# EAGLE design cfs_5 (EAGLE 8.2.2)
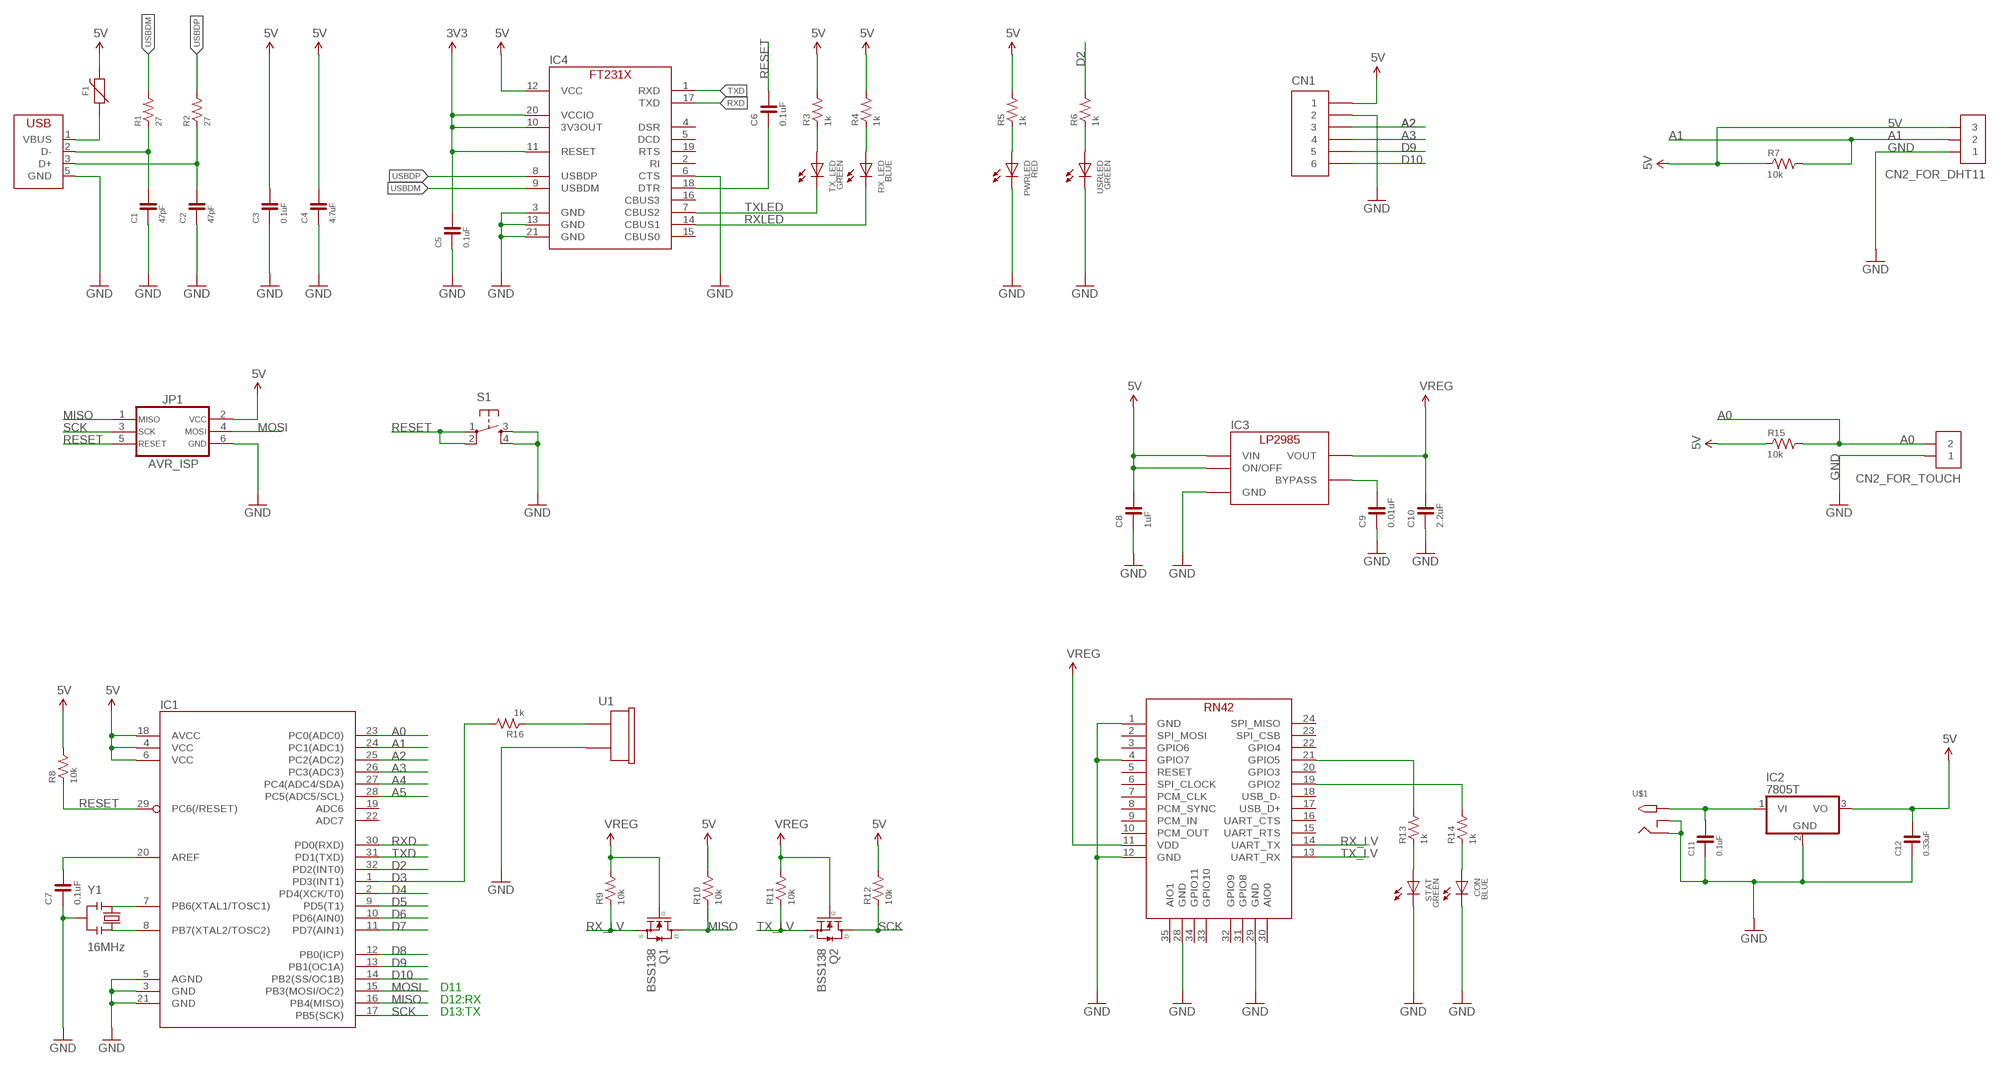
[diagram p0: schematic, sheet 1]

## Parts
C1  47pF  CAPACITOR-0603  [EIA0603]
C2  47pF  CAPACITOR-0603  [EIA0603]
C3  0.1uF  CAPACITOR-0603  [EIA0603]
C4  4.7uF  CAPACITOR-0603  [EIA0603]
C5  0.1uF  CAPACITOR-0603  [EIA0603]
C6  0.1uF  CAPACITOR-0603  [0603]
C7  0.1uF  CAPACITOR-0603  [0603]
C8  1uF  CAPACITOR-0603  [0603]
C9  0.01uF  CAPACITOR-0603  [0603]
C10  2.2uF  CAPACITOR-0603  [0603]
C11  0.1uF  CAPACITOR-0603  [EIA0603]
C12  0.33uF  CAPACITOR-0603  [EIA0603]
CN1  PIN_HEADER_1X6  [PIN_1X6]
CN2_FOR_DHT11  PIN_HEADER_1X3  [PIN_1X3]
CN2_FOR_TOUCH  PIN_HEADER_1X2  [PIN_1X2]
CON  BLUE  LED-0603  [0603]
F1  FUSE-NANO  [NANOSMDC035F]
IC1  ATMEGA328P-AU  [TQFP-32]
IC2  7805T  [TO220H]
IC3  LP2985-33DBV  [SOT-23-5]
IC4  FT231XQ  [QFN-20_FT231X]
JP1  AVR_ISP  AVR_ISP-TC2030_NOHOLE  [TC2030]
PWRLED  RED  LED-0603  [0603]
Q1  BSS138  MOSFET-N  [SOT23-3]
Q2  BSS138  MOSFET-N  [SOT23-3]
R1  27  RESISTOR-0603  [EIA0603]
R2  27  RESISTOR-0603  [EIA0603]
R3  1k  RESISTOR-0603  [0603]
R4  1k  RESISTOR-0603  [0603]
R5  1k  RESISTOR-0603  [0603]
R6  1k  RESISTOR-0603  [0603]
R7  10k  RESISTOR-0603  [0603]
R8  10k  RESISTOR-0603  [0603]
R9  10k  RESISTOR-0603  [0603]
R10  10k  RESISTOR-0603  [0603]
R11  10k  RESISTOR-0603  [0603]
R12  10k  RESISTOR-0603  [0603]
R13  1k  RESISTOR-0603  [0603]
R14  1k  RESISTOR-0603  [0603]
R15  10k  RESISTOR-0603  [0603]
R16  1k  RESISTOR-0603  [0603]
RX_LED  BLUE  LED-0603  [0603]
S1  TACT-SWITCH-SMD_KMR2  [KMR2]
STAT  GREEN  LED-0603  [0603]
TX_LED  GREEN  LED-0603  [0603]
U1  BUZZER  [PKM13EPYH4000-A0]
U$1  2.1MMJACKTHM  [PJ-102A]
U$4  MICROCHIP-RN42  [MICROCHIP-RN42]
USB1  USB-MICRO_B_SMT_HIROSE  [ZX62R-B-5P]
USRLED  GREEN  LED-0603  [0603]
Y1  16MHz  RESONATOR-CSTCE_V  [CSTCE_V]

## Nets
3V3: C5.2 IC4.10(3V3OUT) IC4.11(RESET) IC4.20(VCCIO)
5V: C3.2 C4.2 C8.2 C12.2 CN1.1 CN2_FOR_DHT11.3 F1.2 IC1.4(VCC) IC1.6(VCC) IC1.18(AVCC) IC2.3(VO) IC3.1(VIN) IC3.3(ON/OFF) IC4.12(VCC) JP1.2 R3.2 R4.2 R5.2 R7.1 R8.2 R10.2 R12.2 R15.1
A0: CN2_FOR_TOUCH.2 IC1.23(PC0(ADC0)) R15.2
A1: CN2_FOR_DHT11.2 IC1.24(PC1(ADC1)) R7.2
A2: CN1.3 IC1.25(PC2(ADC2))
A3: CN1.4 IC1.26(PC3(ADC3))
A4: IC1.27(PC4(ADC4/SDA))
A5: IC1.28(PC5(ADC5/SCL))
D2: IC1.32(PD2(INT0)) R6.2
D3: IC1.1(PD3(INT1)) R16.2
D4: IC1.2(PD4(XCK/T0))
D5: IC1.9(PD5(T1))
D6: IC1.10(PD6(AIN0))
D7: IC1.11(PD7(AIN1))
D8: IC1.12(PB0(ICP))
D9: CN1.5 IC1.13(PB1(OC1A))
D10: CN1.6 IC1.14(PB2(SS/OC1B))
DM: C2.2 R2.1 USB1.3(D+)
DP: C1.2 R1.1 USB1.2(D-)
DTR: C6.1 IC4.18(DTR)
GND [GND]: C1.1 C2.1 C3.1 C4.1 C5.1 C7.1 C8.1 C9.1 C10.1 C11.1 C12.1 CN1.2 CN2_FOR_DHT11.1 CN2_FOR_TOUCH.1 CON.CATHODE IC1.3(GND) IC1.5(AGND) IC1.21(GND) IC2.2(GND) IC3.2(GND) IC4.3(GND) IC4.6(CTS) IC4.13(GND) IC4.21(GND) JP1.6 PWRLED.CATHODE S1.3 S1.4 STAT.CATHODE U1.2 U$1.RING U$1.RING_SW U$4.1(GND) U$4.4(GPIO7) U$4.12(GND) U$4.28(GND) U$4.29(GND) USB1.5(GND) USRLED.CATHODE Y1.2
MISO: IC1.16(PB4(MISO)) JP1.1 Q1.3(D) R10.1
MOSI: IC1.15(PB3(MOSI/OC2)) JP1.4
N$1: R3.1 TX_LED.ANODE
N$2: C7.2 IC1.20(AREF)
N$3: IC1.8(PB7(XTAL2/TOSC2)) Y1.3
N$4: IC1.7(PB6(XTAL1/TOSC1)) Y1.1
N$5: C9.2 IC3.4(BYPASS)
N$6: F1.1 USB1.1(VBUS)
N$7: R4.1 RX_LED.ANODE
N$8: R13.2 U$4.21(GPIO5)
N$9: R14.2 U$4.19(GPIO2)
N$10: R13.1 STAT.ANODE
N$11: CON.ANODE R14.1
N$12: C11.2 IC2.1(VI) U$1.TIP
N$13: PWRLED.ANODE R5.1
N$14: R16.1 U1.1
N$15: R6.1 USRLED.ANODE
RESET: C6.2 IC1.29(PC6(/RESET)) JP1.5 R8.1 S1.1 S1.2
RX_LV: Q1.2(S) R9.1 U$4.14(UART_TX)
RXD: IC1.30(PD0(RXD)) IC4.17(TXD)
RXLED: IC4.14(CBUS1) RX_LED.CATHODE
SCK: IC1.17(PB5(SCK)) JP1.3 Q2.3(D) R12.1
TX_LV: Q2.2(S) R11.1 U$4.13(UART_RX)
TXD: IC1.31(PD1(TXD)) IC4.1(RXD)
TXLED: IC4.7(CBUS2) TX_LED.CATHODE
USBDM: IC4.9(USBDM) R1.2
USBDP: IC4.8(USBDP) R2.2
VREG: C10.2 IC3.5(VOUT) Q1.1(G) Q2.1(G) R9.2 R11.2 U$4.11(VDD)
Unconnected: IC1.19(ADC6) IC1.22(ADC7) IC4.2(RI) IC4.4(DSR) IC4.5(DCD) IC4.15(CBUS0) IC4.16(CBUS3) IC4.19(RTS) U$4.2(SPI_MOSI) U$4.3(GPIO6) U$4.5(RESET) U$4.6(SPI_CLOCK) U$4.7(PCM_CLK) U$4.8(PCM_SYNC) U$4.9(PCM_IN) U$4.10(PCM_OUT) U$4.15(UART_RTS) U$4.16(UART_CTS) U$4.17(USB_D+) U$4.18(USB_D-) U$4.20(GPIO3) U$4.22(GPIO4) U$4.23(SPI_CSB) U$4.24(SPI_MISO) U$4.30(AIO0) U$4.31(GPIO8) U$4.32(GPIO9) U$4.33(GPIO10) U$4.34(GPIO11) U$4.35(AIO1)

## Notes on the sheet
- D11
- D12:RX
- D13:TX

## Library data of the parts
C1-C5 C11 C12 = u-aizu:CAPACITOR
C6-C10 = FaBo-Capacitor:CAPACITOR: CAPACITOR
CN1 = FaBo-PIN:PIN_HEADER_1X6
CN2_FOR_DHT11 = FaBo-PIN:PIN_HEADER_1X3
CN2_FOR_TOUCH = FaBo-PIN:PIN_HEADER_1X2
CON PWRLED RX_LED STAT TX_LED USRLED = FaBo-LED:LED
F1 = u-aizu:FUSE
IC1 = FaBo-MPU:ATMEGA328
IC2 = adafruit:78*: Positive VOLTAGE REGULATOR Added bigger pads to the TO-92 package
IC3 = FaBo-Supply:LP2985: LP2985
IC4 = u-aizu:FT231X
JP1 = FaBo-PIN:AVR_ISP
Q1 Q2 = FaBo-etc:MOSFET-N
R1 R2 = u-aizu:RESISTOR
R3-R16 = FaBo-Resistors:RESISTOR: RESISTOR
S1 = FaBo-Switch:TACT-SWITCH
U1 = FaBo-Parts:BUZZER
U$1 = adafruit:2.1MMJACK: 2.1mm x 5.5mm THM DC jack with internal switch. Digikey part #PJ-102A, 4UCON part #05537 2.1mm x 5.5mm SMT DC jack with internal switch. Digikey part #PJ-002A-SMT, 4UCON part #03267 By microbuilder.eu & adafruit.com
U$4 = FaBo-BT:MICROCHIP-RN42
USB1 = u-aizu:USB
Y1 = FaBo-etc:RESONATOR: RESONATOR

## Net classes
1 5V: width 0.305 mm, drill 0.406 mm
2 GND: width 0.305 mm, drill 0.406 mm

## Board
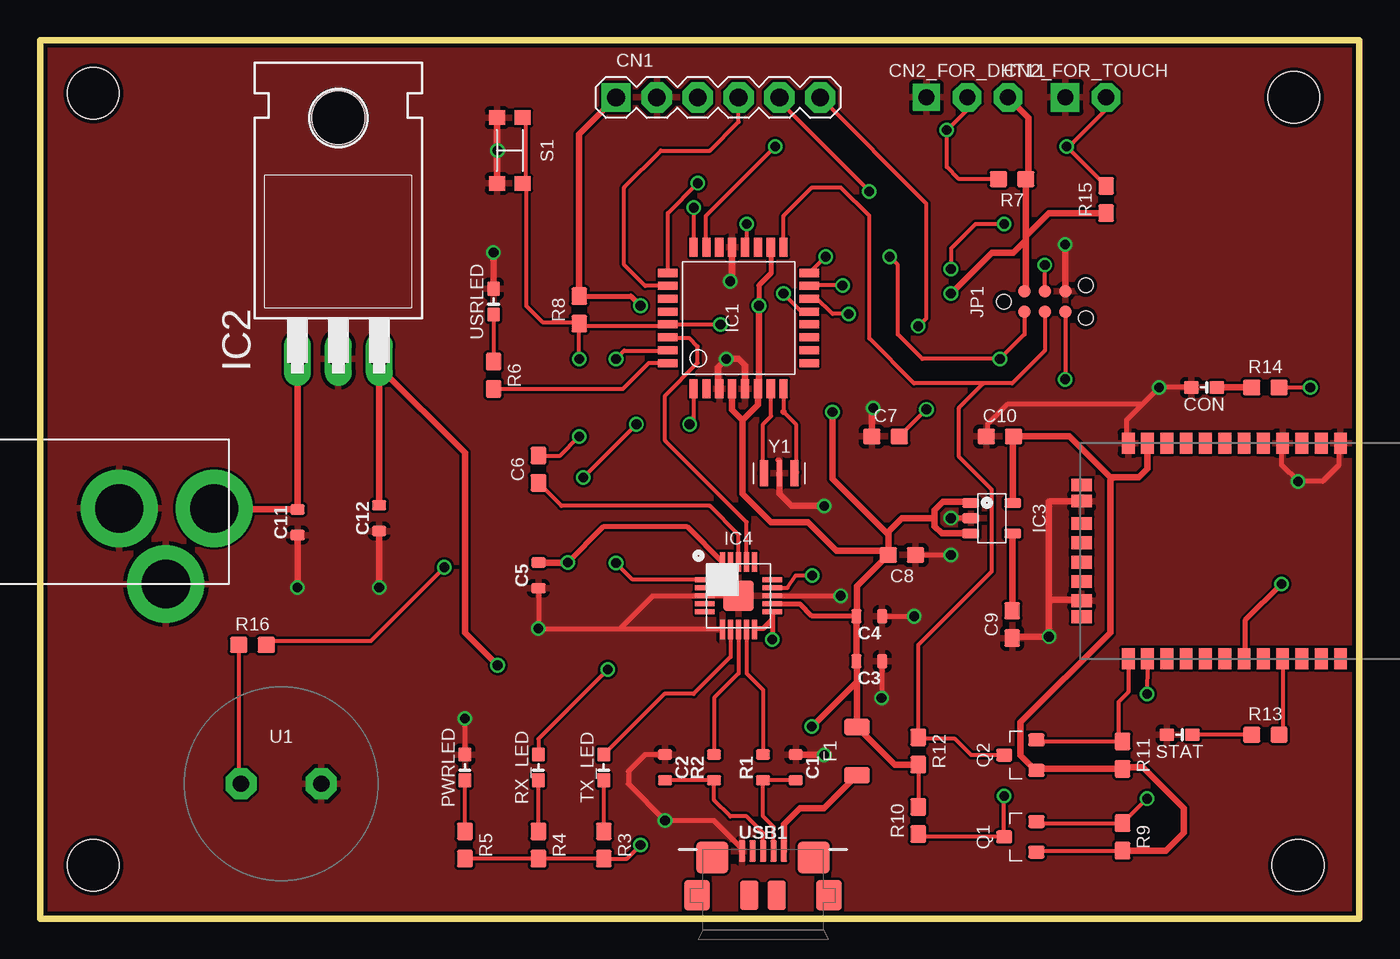
[diagram p1: board, top side]
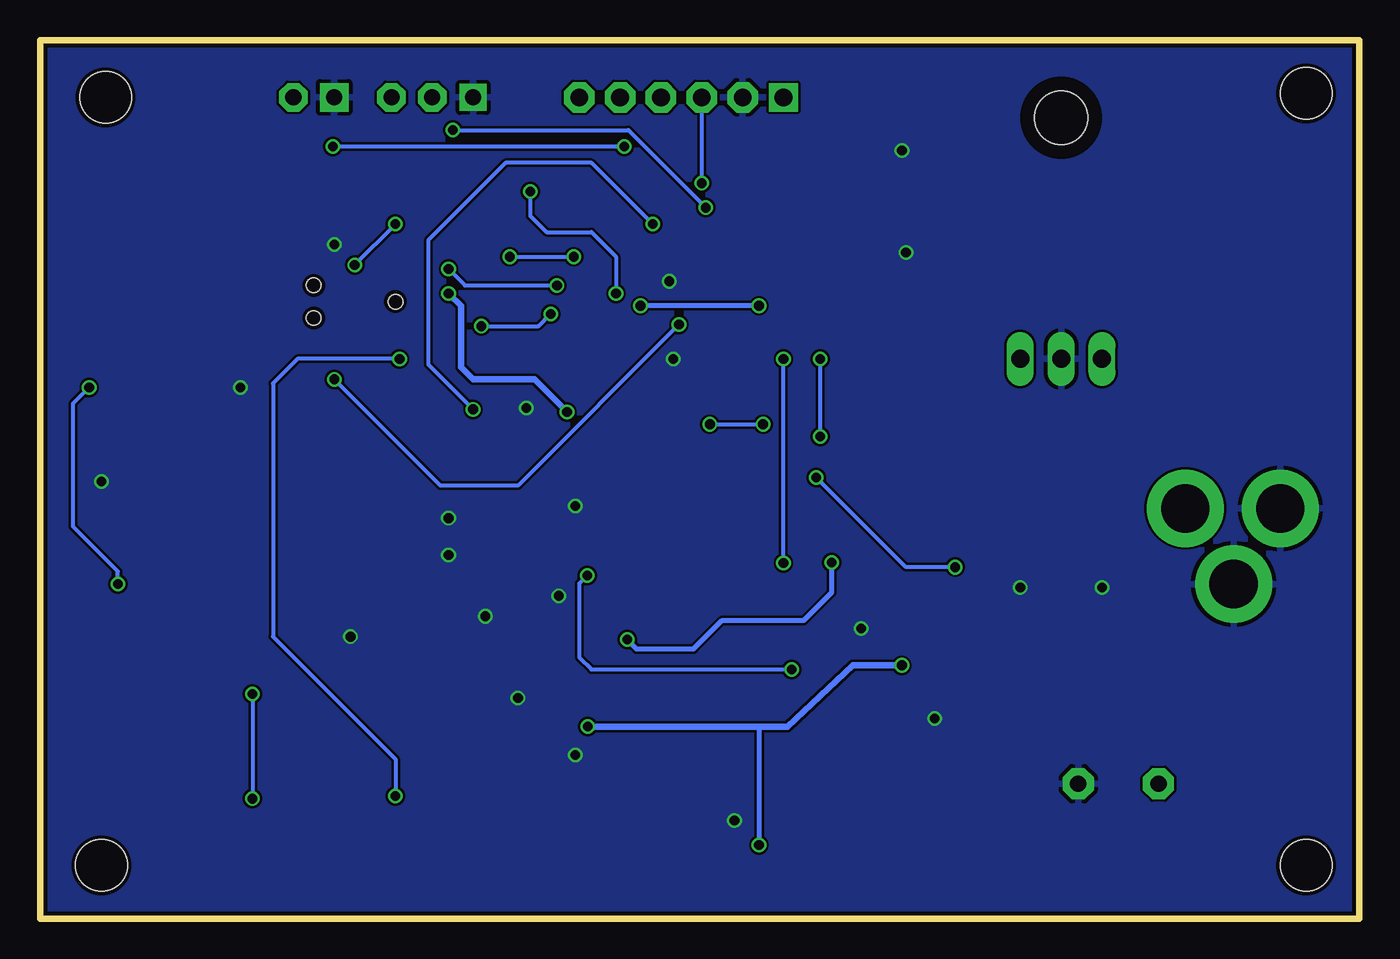
[diagram p2: board, bottom side, seen from below]

Size 82.04 x 54.61 mm. Coordinates in mm from the lower left corner, seen from the top.
Outline: 0,54.61 82.04,54.61 82.04,0 0,0 0,54.61
Copper layers (1*16): Top 0.035mm / dielectric 1.5mm / Bottom 0.035mm
Design rules "SeeedStudio_2layer_DRU_no_angle_20140221": minimum track width 6mil, minimum drill 12mil, track to track 6mil, track to pad 6mil, pad to pad 6mil, via to via 6mil, smd to smd 0mil, copper to edge 10mil, drill to drill 10mil, minimum pad ring 10mil, minimum via ring 6mil, stop-mask expansion 2mil, vias tented up to drill 100mil, thermal gap 10mil
Holes 3.2 mm at 3.3,51.31 3.3,3.3 78.23,3.3 77.98,51.05

### Footprints (pad centres in the part's own frame; a part is rotated, then mirrored left to right if it is on the bottom)
EIA0603 = smd 0.65 x 0.9: 1 -0.8,0; 2 0.8,0
0603 = smd 1.1 x 1: 1 -0.85,0; 2 0.85,0
PIN_1X6 = drill 1.1 pad 1.778 square: 1 -6.35,0 | drill 1.1 pad 1.9 octagon: 2 -3.81,0; 3 -1.27,0; 4 1.27,0; 5 3.81,0; 6 6.35,0
PIN_1X3 = drill 1 pad 1.676 square: 1 -2.54,0 | drill 1 pad 1.778 octagon: 2 0,0; 3 2.54,0
PIN_1X2 = drill 1 pad 1.778 square: 1 -1.27,0 | drill 1 pad 1.778 octagon: 2 1.27,0
0603' = smd 0.9 x 0.8: ANODE -0.8,0; CATHODE 0.8,0
NANOSMDC035F = smd 1 x 1.6: 1 -1.5,0; 2 1.5,0
TQFP-32 = smd 1.2 x 0.5: 1 -4.4,2.8; 2 -4.4,2; 3 -4.4,1.2; 4 -4.4,0.4; 5 -4.4,-0.4; 6 -4.4,-1.2; 7 -4.4,-2; 8 -4.4,-2.8; 17 4.4,-2.8; 18 4.4,-2; 19 4.4,-1.2; 20 4.4,-0.4; 21 4.4,0.4; 22 4.4,1.2; 23 4.4,2; 24 4.4,2.8 | smd 0.5 x 1.2: 9 -2.8,-4.4; 10 -2,-4.4; 11 -1.2,-4.4; 12 -0.4,-4.4; 13 0.4,-4.4; 14 1.2,-4.4; 15 2,-4.4; 16 2.8,-4.4; 25 2.8,4.4; 26 2,4.4; 27 1.2,4.4; 28 0.4,4.4; 29 -0.4,4.4; 30 -1.2,4.4; 31 -2,4.4; 32 -2.8,4.4
TO220H = drill 1.118 long: 1 -2.54,-10.16; 2 0,-10.16; 3 2.54,-10.16 | hole 3.302: 0,4.826
SOT-23-5 = smd 0.6 x 1.05: 1 -0.95,-1.3; 2 0,-1.3; 3 0.95,-1.3; 4 0.95,1.3; 5 -0.95,1.3
QFN-20_FT231X = smd 1.2 x 0.3: 1 -2.1,1; 2 -2.1,0.5; 3 -2.1,0; 4 -2.1,-0.5; 5 -2.1,-1; 11 2.1,-1; 12 2.1,-0.5; 13 2.1,0; 14 2.1,0.5; 15 2.1,1 | smd 0.3 x 1.2: 6 -1,-2.1; 7 -0.5,-2.1; 8 0,-2.1; 9 0.5,-2.1; 10 1,-2.1; 16 1,2.1; 17 0.5,2.1; 18 0,2.1; 19 -0.5,2.1; 20 -1,2.1 | smd 1.9 x 1.9: 21 0,0
TC2030 = smd 0.787 x 0.787: 1 -1.27,-0.635; 2 -1.27,0.635; 3 0,-0.635; 4 0,0.635; 5 1.27,-0.635; 6 1.27,0.635 | hole 0.889: -2.54,0; 2.54,-1.016; 2.54,1.016
SOT23-3 = smd 0.8 x 1: 1 -0.95,-1; 2 0.95,-1; 3 0,1
KMR2 = smd 0.9 x 1: 1 -2.05,0.8; 2 2.05,0.8; 3 2.05,-0.8; 4 -2.05,-0.8
PKM13EPYH4000-A0 = drill 1 pad 1.93 octagon: 1 -2.5,0; 2 2.5,0
PJ-102A = drill 3 pad 4.8: RING 0.1,-3.39; RING_SW -4.6,-6.29; TIP 0.1,-9.29
MICROCHIP-RN42 = smd 1.3 x 0.8: 1 -6.7,3.4; 2 -6.7,2.2; 3 -6.7,1; 4 -6.7,-0.2; 5 -6.7,-1.4; 6 -6.7,-2.6; 7 -6.7,-3.8; 8 -6.7,-5; 9 -6.7,-6.2; 10 -6.7,-7.4; 11 -6.7,-8.6; 12 -6.7,-9.8; 13 6.7,-9.8; 14 6.7,-8.6; 15 6.7,-7.4; 16 6.7,-6.2; 17 6.7,-5; 18 6.7,-3.8; 19 6.7,-2.6; 20 6.7,-1.4; 21 6.7,-0.2; 22 6.7,1; 23 6.7,2.2; 24 6.7,3.4 | smd 0.8 x 1.3: 28 3.1,-12.7; 29 -3.1,-12.7; 30 4.1,-12.7; 31 1.9,-12.7; 32 0.7,-12.7; 33 -0.5,-12.7; 34 -1.7,-12.7; 35 -4.1,-12.7
ZX62R-B-5P = smd 0.4 x 1.35: 1 1.3,4.2; 2 0.65,4.2; 3 0,4.2; 4 -0.65,4.2; 5 -1.3,4.2 | smd 2 x 2: 6 3.15,3.8; 7 -3.15,3.8 | smd 1.6 x 1.9: 8 4.1,1.45; 11 -4.1,1.45 | smd 1.1 x 1.8: 9 0.85,1.45; 10 -0.85,1.45
CSTCE_V = smd 0.5 x 1.6: 1 -0.95,0; 3 0.95,0 | smd 0.3 x 1.6: 2 0,0

### Placement (x,y rotation side)
C1  46.99,9.4 270 top
C2  38.86,9.4 270 top
C3  51.56,16 180 top
C4  51.56,18.8 180 top
C5  30.99,21.34 90 top
C6  30.99,27.94 90 top
C7  52.58,29.97 0 top
C8  53.59,22.61 180 top
C9  60.45,18.29 90 top
C10  59.69,29.97 0 top
C11  16,24.64 90 top
C12  21.08,24.89 90 top
CN1  42.16,51.05 0 top
CN2_FOR_DHT11  57.66,51.05 0 top
CN2_FOR_TOUCH  65.02,51.05 0 top
CON  BLUE  [0603']  72.39,33.02 180 top
F1  50.8,10.41 90 top
IC1  43.43,37.34 90 top
IC2  18.54,44.96 0 top
IC3  59.18,24.89 270 top
IC4  43.43,20.07 0 top
JP1  62.48,38.35 0 top
PWRLED  RED  [0603']  26.42,9.4 90 top
Q1  60.96,5.08 90 top
Q2  60.96,10.16 90 top
R1  44.96,9.4 90 top
R2  41.91,9.4 90 top
R3  35.05,4.57 270 top
R4  30.99,4.57 270 top
R5  26.42,4.57 270 top
R6  28.19,33.78 270 top
R7  60.45,45.97 180 top
R8  33.53,37.85 90 top
R9  67.31,5.08 270 top
R10  54.61,6.1 90 top
R11  67.31,10.16 270 top
R12  54.61,10.41 270 top
R13  76.2,11.43 0 top
R14  76.2,33.02 0 top
R15  66.29,44.7 90 top
R16  13.21,17.02 0 top
RX_LED  BLUE  [0603']  30.99,9.4 90 top
S1  29.21,47.75 270 top
STAT  GREEN  [0603']  70.87,11.43 180 top
TX_LED  GREEN  [0603']  35.05,9.4 90 top
U1  14.99,8.38 0 top
U$1  1.52,25.4 90 top
U$4  77.47,22.86 270 top
USB1  44.96,0 0 top
USRLED  GREEN  [0603']  28.19,38.35 90 top
Y1  45.97,27.69 0 top

### Tracks (layer width: path | path; a pad name or v marks a point on that pad's centre or on a via)
3V3  (via drill 0.6)
  Top 0.254: IC4.11 45.53,18.61 | 44.5,18.03 IC4.10
  Top 0.305: v32.8,22.14 35.05,24.38 40.22,24.38 IC4.20 | 45.53,18.61 44.96,18.03 44.5,18.03 | IC4.11 v45.53,17.34
  Top 0.406: C5.2 v32.8,22.14
  Bottom 0.305: v45.53,17.34 44.96,16.76 41.4,16.76 39.62,18.54 34.54,18.54 32.8,20.28 v32.8,22.14
5V  (via drill 0.6)
  Top 0.254: R5.2 R4.2 R3.2 36.49,3.72 v37.34,4.57 | R12.2 R10.2 | 47.24,19.57 47.24,19.56
  Top 0.305: C4.2 48.01,18.8 47.24,19.56 | R8.2 36.74,38.7 v37.34,38.1 | IC4.12 47.24,19.57 | 45.47,41.71 45.47,40.13 44.7,39.37 v44.7,38.1
  Top 0.406: IC2.3 21.08,34.29 | 21.08,34.29 C12.2 | 50.8,14.73 F1.2 53.15,9.56 R12.2 | 50.8,14.73 50.8,15.96 C3.2 C4.2 50.8,18.8 50.8,20.66 C8.2 | IC3.3 56.07,23.94 55.63,24.38 55.63,24.89 | 55.63,24.89 55.63,25.4 56.13,25.91 57.82,25.91 IC3.1 | C8.2 52.74,23.88 | 52.74,23.88 52.74,24.04 53.59,24.89 55.63,24.89 | 43.69,30.99 44.63,31.93 IC1.6 44.7,33.02 v44.7,38.1 | 43.69,30.99 43.69,26.42 45.47,24.64 47.75,24.64 49.53,22.86 52.49,22.86 C8.2 | IC1.4 43.03,31.64 43.69,30.99 | 45.47,41.71 IC1.18 | v28.45,15.75 26.42,17.78 26.42,28.96 21.08,34.29 | v47.98,11.94 48.01,11.94 50.8,14.73 | CN2_FOR_DHT11.3 61.47,49.78 61.47,46.39 R7.1 61.3,42.42 | R8.2 33.53,48.77 CN1.1 | 61.3,42.42 61.3,42.16 | 61.3,42.16 61.3,39.08 | 61.3,38.86 61.3,39.08 | 61.3,39.08 JP1.2 | R15.1 62.74,43.85 61.3,42.42 | v49.28,31.5 49.28,27.34 52.74,23.88 | v56.64,38.86 59.18,41.4 60.54,41.4 61.3,42.16
  Bottom 0.305: v37.34,38.1 v44.7,38.1 | 37.34,11.94 v37.34,4.57
  Bottom 0.406: v28.45,15.75 31.5,15.75 35.56,11.94 37.34,11.94 v47.98,11.94 | v49.28,31.5 51.31,33.53 55.12,33.53 55.88,34.29 55.88,38.1 v56.64,38.86
A0  (via drill 0.6)
  Top 0.254: R15.2 63.93,47.92 66.29,50.29 CN2_FOR_TOUCH.2 | 41.4,41.77 41.4,43.69 v45.72,48.01
  Top 0.406: 41.4,41.77 IC1.23 | v63.84,48.01 63.93,47.92
  Bottom 0.254: v63.84,48.01 v45.72,48.01
A1  (via drill 0.6)
  Top 0.254: CN2_FOR_DHT11.2 57.66,50.29 v56.39,49.02 56.39,46.74 57.15,45.97 R7.2 | v40.64,44.2 IC1.24
  Top 0.406: IC1.24
  Bottom 0.254: v56.39,49.02 45.47,49.02 v40.64,44.2
A2  (via drill 0.6)
  Top 0.254: IC1.25 39.03,43.86 v40.89,45.72
  Bottom 0.254: v40.89,45.72 CN1.3
A3
  Top 0.254: IC1.26 37.62,39.34 36.32,40.64 36.32,45.47 38.61,47.75 41.66,47.75 43.43,49.53 CN1.4
D2
  Top 0.254: IC1.32 37.84,34.54 36.23,32.93 R6.2
D3  (via drill 0.6)
  Top 0.152: R16.2 14.31,17.27
  Top 0.254: IC1.1 40.63,31.76 40.64,30.99 v40.39,30.73 | v25.15,21.84 20.57,17.27 14.31,17.27 | v37.08,30.73 v33.78,27.43
  Bottom 0.254: v40.39,30.73 v37.08,30.73 | v25.15,21.84 28.19,21.84 v33.78,27.43
D9  (via drill 0.6)
  Top 0.254: 45.97,50.8 v51.56,45.21 | v46.23,38.86 47.35,37.74 IC1.13
  Top 0.406: CN1.5 45.97,50.8
  Bottom 0.254: v51.56,45.21 51.56,43.69 50.55,42.67 47.75,42.67 46.23,41.15 v46.23,38.86
D10  (via drill 0.6)
  Top 0.254: CN1.6 55.12,44.45 55.12,37.34 v54.61,36.83 | v50.29,37.59 49.28,37.59 48.26,38.61 47.9,38.61
  Top 0.406: 47.9,38.61 IC1.14
  Bottom 0.254: v54.61,36.83 51.05,36.83 v50.29,37.59
DM
  Top 0.254: USB1.3 44.96,5.33 43.94,6.35 42.93,6.35 41.91,7.37 R2.1 C2.2
DP
  Top 0.254: C1.2 R1.1 44.96,6.35 45.61,5.7 USB1.2
DTR
  Top 0.254: IC4.18 43.43,23.88 41.66,25.65 32.42,25.65 C6.1
GND  (via drill 0.6)
  Top 0.305: C5.1 v30.99,18.03 36.07,18.03 | PWRLED.CATHODE v26.42,12.45 | C4.1 v54.36,18.8 | 43.66,4.35 41.91,6.1 v38.86,6.1 36.58,8.38 36.58,9.14 37.63,10.2 C2.1 | C3.1 52.36,13.75 v52.32,13.72 | 80.77,29.46 80.77,28.19 79.76,27.18 v78.23,27.18 77.22,28.19 77.22,29.51 | CON.CATHODE v69.6,33.02 68.58,32 | 58.93,29.97 58.93,30.73 60.2,32 68.58,32 | IC3.2 v56.64,24.89 | C8.1 v56.64,22.61 | 36.07,18.03 38.1,20.07 IC4.3 IC4.21 | IC4.13 v49.78,20.07 | 68.58,32 67.56,30.99 67.56,29.67 U$4.12 | 36.07,18.03 42.37,18.03 IC4.6 | 45.87,28.5 45.97,28.5
  Top 0.406: C11.1 v16,20.57 | C12.1 v21.08,20.57 | USB1.5 43.66,4.35 | 60.62,17.44 60.71,17.53 | U$4.1 80.77,29.46 | 77.22,29.51 U$4.4 | JP1.6 v63.75,41.91 | 28.19,39.12 USRLED.CATHODE v28.19,41.4 | S1.3 28.41,47.71 v28.45,47.75 28.41,47.79 S1.4 | IC1.5 43.83,34.4 43.43,34.8 v42.67,34.8 42.16,34.29 42.16,33.01 IC1.3 | Y1.2 45.97,26.42 46.74,25.65 v48.77,25.65 | C7.1 51.73,31.66 v51.82,31.75 | C10.1 58.93,29.97 | IC1.21 43.03,39.73 v42.93,39.62 | C1.1 48.73,10.2 v48.77,10.16 | C9.1 60.54,17.53 v62.74,17.53 62.74,19.81 | 62.74,19.81 64.72,19.81 U$4.28 | U$4.29 62.79,25.96 62.74,25.91 62.74,19.81
  pour Bottom: -1.02,56.64 84.33,56.64 84.33,-2.29 -1.02,-2.29
  pour Top: -1.78,58.17 86.87,58.17 86.87,-5.08 -1.78,-5.08
MISO  (via drill 0.6)
  Top 0.254: JP1.1 61.21,36.32 v59.69,34.8 54.86,34.8 53.34,36.32 53.34,40.64 v52.83,41.15 | v48.84,41.15 IC1.16 | Q1.3 54.78,5.08 | 59.94,5.1 v59.94,7.62
  Top 0.406: 54.78,5.08 R10.1 | Q1.3 59.94,5.1
  Bottom 0.254: v52.83,41.15 v48.84,41.15 | v59.69,34.8 66.04,34.8 67.56,33.27 67.56,17.53 59.94,9.91 v59.94,7.62
MOSI  (via drill 0.6)
  Top 0.254: JP1.4 v62.48,40.64 | v59.94,43.18 58.17,43.18 56.64,41.66 v56.64,40.39 | v49.9,39.37 47.87,39.37 IC1.15
  Bottom 0.254: v62.48,40.64 v59.94,43.18 | v56.64,40.39 55.63,39.37 v49.9,39.37
N$1
  Top 0.254: TX_LED.ANODE R3.1
N$2  (via drill 0.6)
  Top 0.254: v55.12,31.66 C7.2 | v43.94,43.18 43.94,41.85 IC1.20
  Bottom 0.254: v55.12,31.66 57.91,34.46 57.91,42.16 53.09,46.99 47.75,46.99 v43.94,43.18
N$3
  Top 0.254: IC1.8 46.23,31.5 | 46.23,31.5 46.99,30.73 46.99,27.75
  Top 0.406: 46.23,31.5 | 46.99,27.75 Y1.3
N$4
  Top 0.254: 44.96,27.69 44.96,30.73 45.47,31.24 45.47,32.91
  Top 0.406: Y1.1 44.96,27.69 | 45.47,32.91 IC1.7
N$5
  Top 0.406: C9.2 60.45,23.91 IC3.4
N$6
  Top 0.406: USB1.1 46.26,5.87 47.24,6.86 48.74,6.86 F1.1
N$7
  Top 0.254: R4.1 RX_LED.ANODE
N$8
  Top 0.254: U$4.21 77.27,11.65
  Top 0.406: 77.27,11.65 R13.2
N$9  (via drill 0.6)
  Top 0.254: R14.2 v78.99,33.02
  Top 0.305: v77.22,20.79 77.18,20.79 74.93,18.54 74.93,16.22 U$4.19
  Bottom 0.254: v78.99,33.02 80.01,32 80.01,24.38 77.22,21.59 v77.22,20.79
N$10
  Top 0.254: R13.1 STAT.ANODE
N$11
  Top 0.406: R14.1 CON.ANODE
N$12
  Top 0.406: IC2.1 C11.2 10.88,25.44 U$1.TIP
N$13
  Top 0.254: R5.1 PWRLED.ANODE
N$14
  Top 0.152: 12.36,8.51 U1.1
  Top 0.254: R16.1 12.36,8.51
N$15
  Top 0.254: USRLED.ANODE R6.1
RESET  (via drill 0.6)
  Top 0.254: C6.2 32.35,28.79 v33.53,29.97 | v33.53,34.8 33.53,36.83 38.86,36.83 IC1.29 v42.31,36.94 | 30.23,45.72 30.23,49.78 | 30.23,45.47 30.23,38.1 31.24,37.08 33.44,37.08 | JP1.5 v63.75,33.53
  Top 0.406: 33.53,36.83 R8.1 33.44,37.08 | 30.23,49.78 S1.1 | 30.23,45.72 S1.2 30.23,45.47
  Bottom 0.254: v33.53,29.97 v33.53,34.8 | v63.75,33.53 57.15,26.92 52.32,26.92 v42.31,36.94
RX_LV  (via drill 0.6)
  Top 0.254: 62.06,5.93 R9.1 v68.83,7.45 | 68.87,15.78 v68.83,13.97
  Top 0.406: Q1.2 62.06,5.93 | U$4.14 68.87,15.78
  Bottom 0.254: v68.83,13.97 v68.83,7.45
RXD
  Top 0.254: IC4.17 43.93,24.65 38.86,29.72 38.86,32.51 40.89,34.54 40.89,35.56 40.39,36.07 39.1,36.07
  Top 0.406: 39.1,36.07 IC1.30
RXLED  (via drill 0.6)
  Top 0.254: v48.01,21.34 46.99,21.34 46.48,20.57 46.47,20.57 IC4.14 | v35.31,15.49 30.99,11.18 RX_LED.CATHODE
  Bottom 0.254: v48.01,21.34 48.51,20.83 48.51,16.26 47.75,15.49 v35.31,15.49
SCK
  Top 0.254: Q2.3 57.91,10.16 56.9,11.18 54.7,11.18 | JP1.3 62.48,35.31 60.45,33.27 58.67,33.27 | 58.67,33.27 54.36,33.27 51.56,36.07 51.56,43.69 49.78,45.47 48.01,45.47 46.23,43.69 IC1.17 | R12.1 54.61,17.02 59.18,21.59 59.18,26.67 57.15,28.7 57.15,31.75 58.67,33.27
  Top 0.406: 54.7,11.18 R12.1
TX_LV
  Top 0.254: 62.06,11.01 R11.1 | U$4.13 67.67,14.08 67.06,13.46 67.06,11.26
  Top 0.406: Q2.2 62.06,11.01 | 67.06,11.26 R11.1
TXD  (via drill 0.6)
  Top 0.254: IC4.1 36.85,21.07 v35.81,22.1 | v35.81,34.8 36.32,35.31 39,35.31
  Top 0.406: 39,35.31 IC1.31
  Bottom 0.254: v35.81,22.1 v35.81,34.8
TXLED
  Top 0.254: IC4.7 42.93,16.26 40.64,13.97 38.82,13.97 TX_LED.CATHODE
USBDM
  Top 0.254: IC4.9 43.93,15.25 44.96,14.22 R1.2
USBDP
  Top 0.254: IC4.8 43.43,15.24 41.91,13.72 R2.2
VREG
  Top 0.254: 62.06,4.23 R9.2 | 67.4,9.4 R11.2
  Top 0.406: Q1.1 62.06,4.23 62.06,4.15 61.98,4.06 | Q2.1 62.06,9.31 | 62.06,9.31 R11.2 | IC3.5 60.48,29.91 C10.2 64.01,29.97 66.55,27.43 66.74,27.43 | 62.06,9.31 61.81,9.31 60.96,10.16 60.96,12.19 66.55,17.78 66.55,27.24 66.74,27.43 | R9.2 70.02,4.23 71.12,5.33 71.12,6.86 68.58,9.4 67.4,9.4 | U$4.11 68.87,27.98 68.33,27.43 66.74,27.43